# EasyEDA Pro project ProPrj_AD9363_Debug_2025-10-27.epro, schematic Schematic1

## Sheets
1 AD9363: Board Name: Board1; Create Date: 2025-09-24; Page Name: AD9363; Project Name: AD9363_Debug; Schematic Name: Schematic1; Update Date: 2025-09-24; Company: 嘉立创EDA; Page Size: A4; Version: V1.0
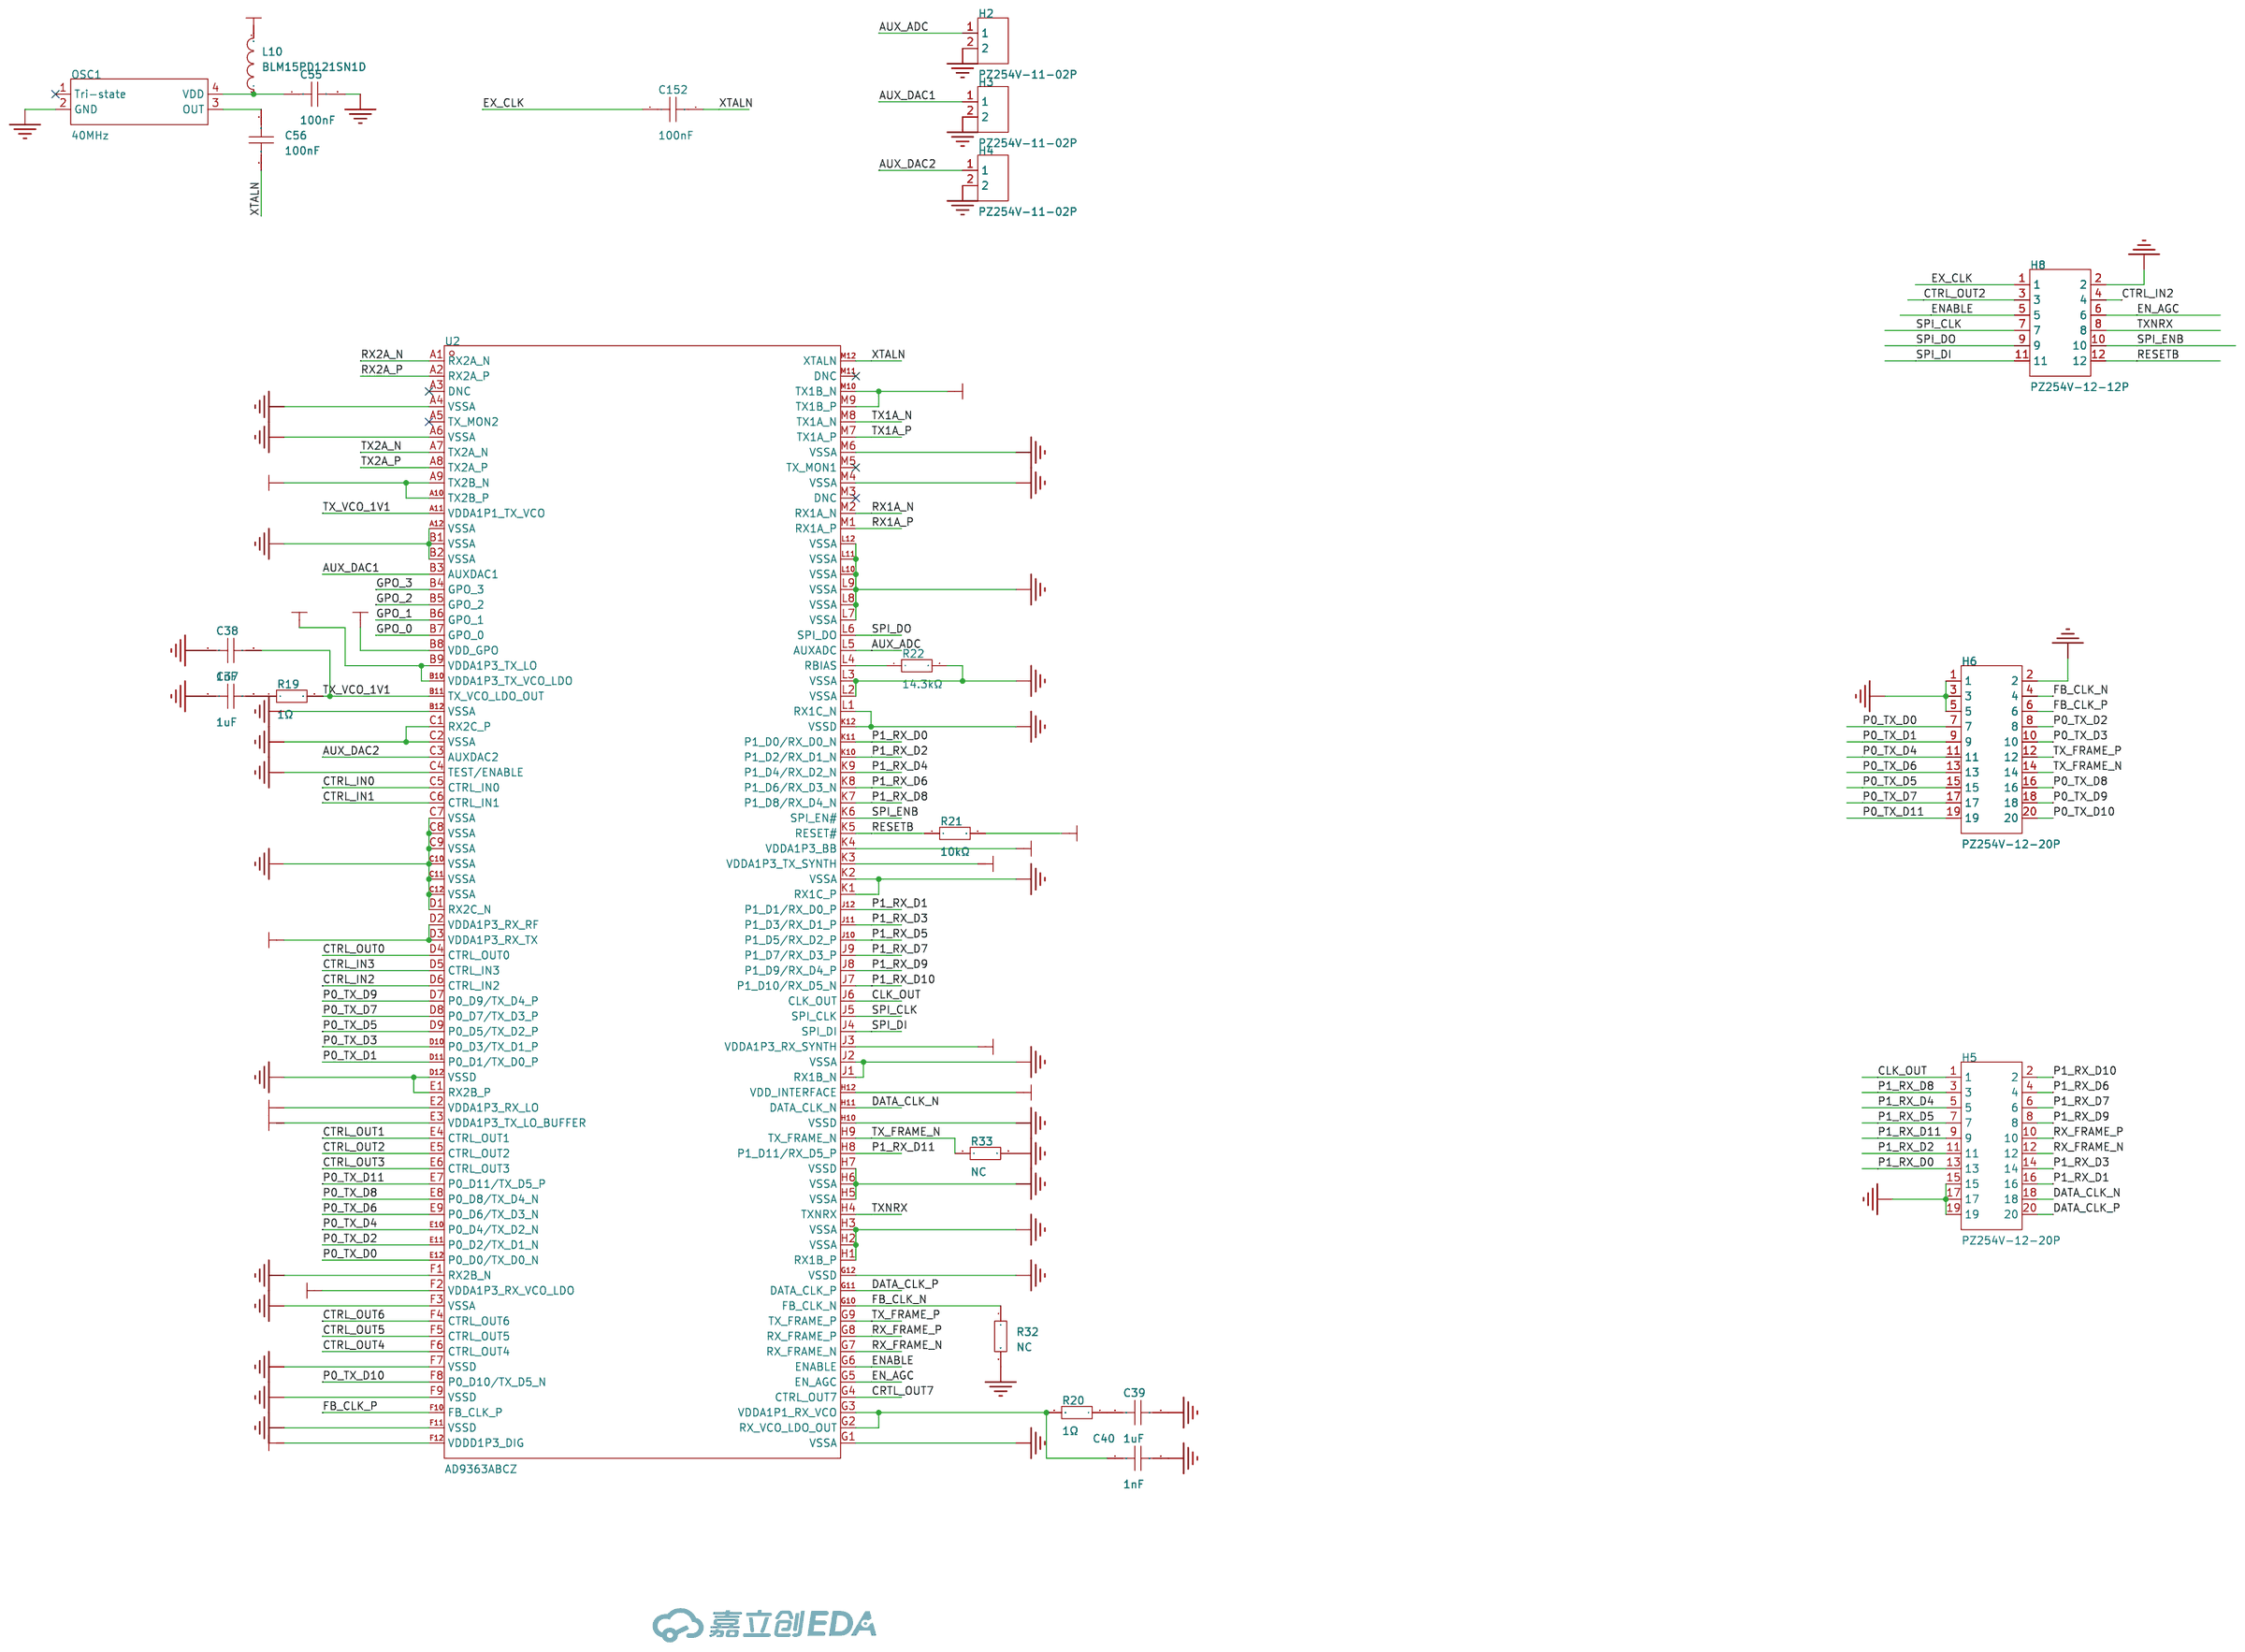
[diagram p0: AD9363]
2 Power: Page Name: Power
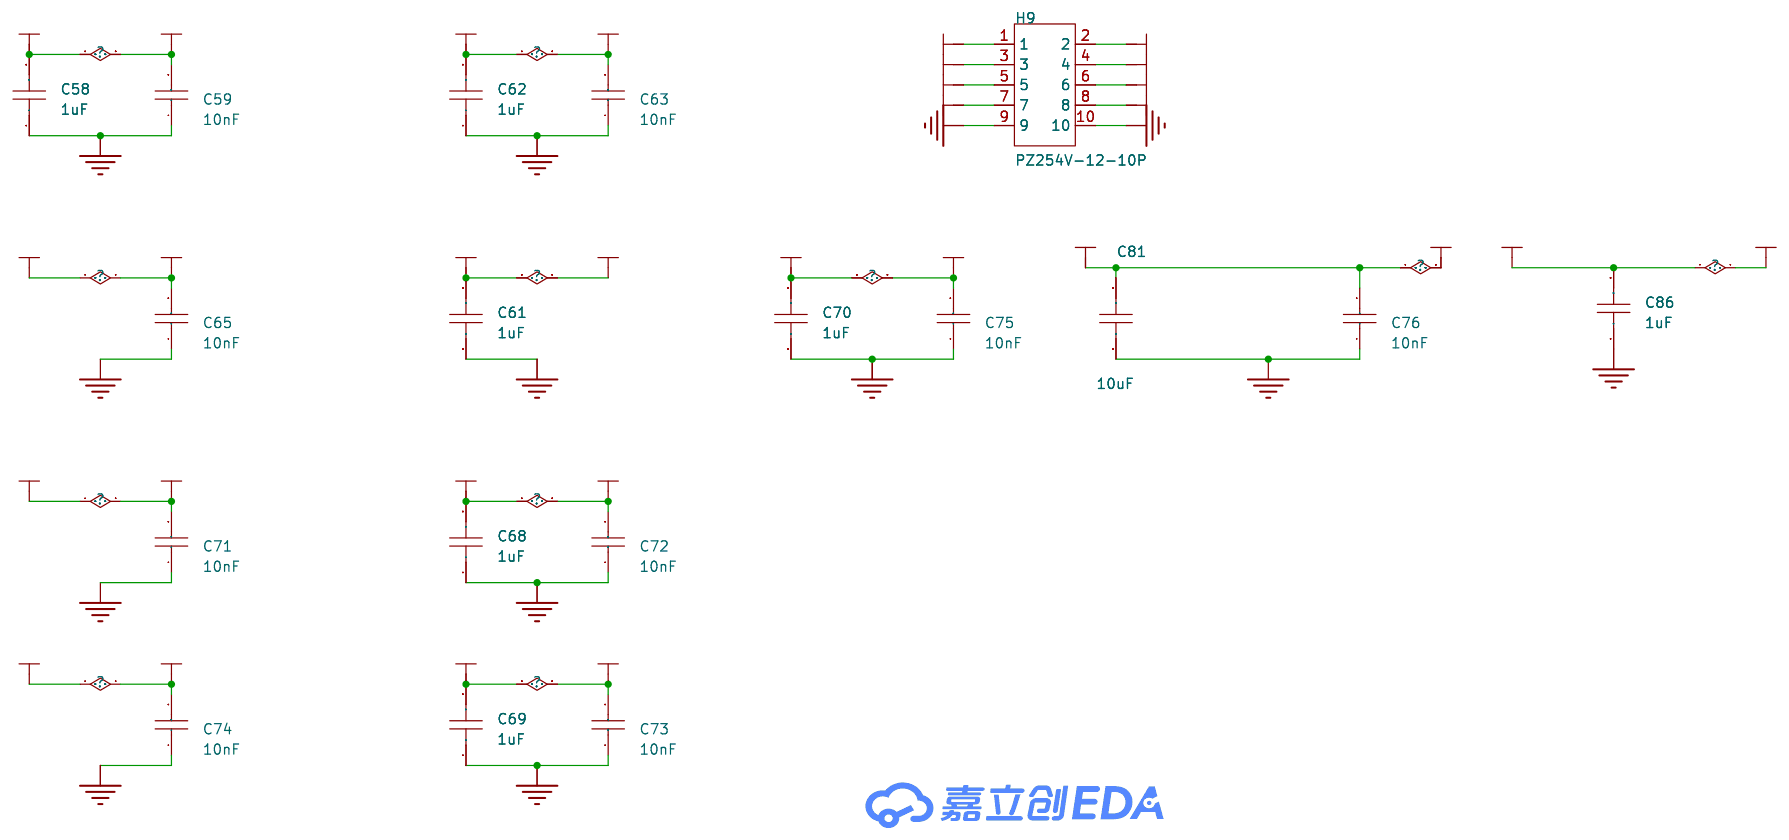
[diagram p1: Power]
3 RF: Page Name: RF
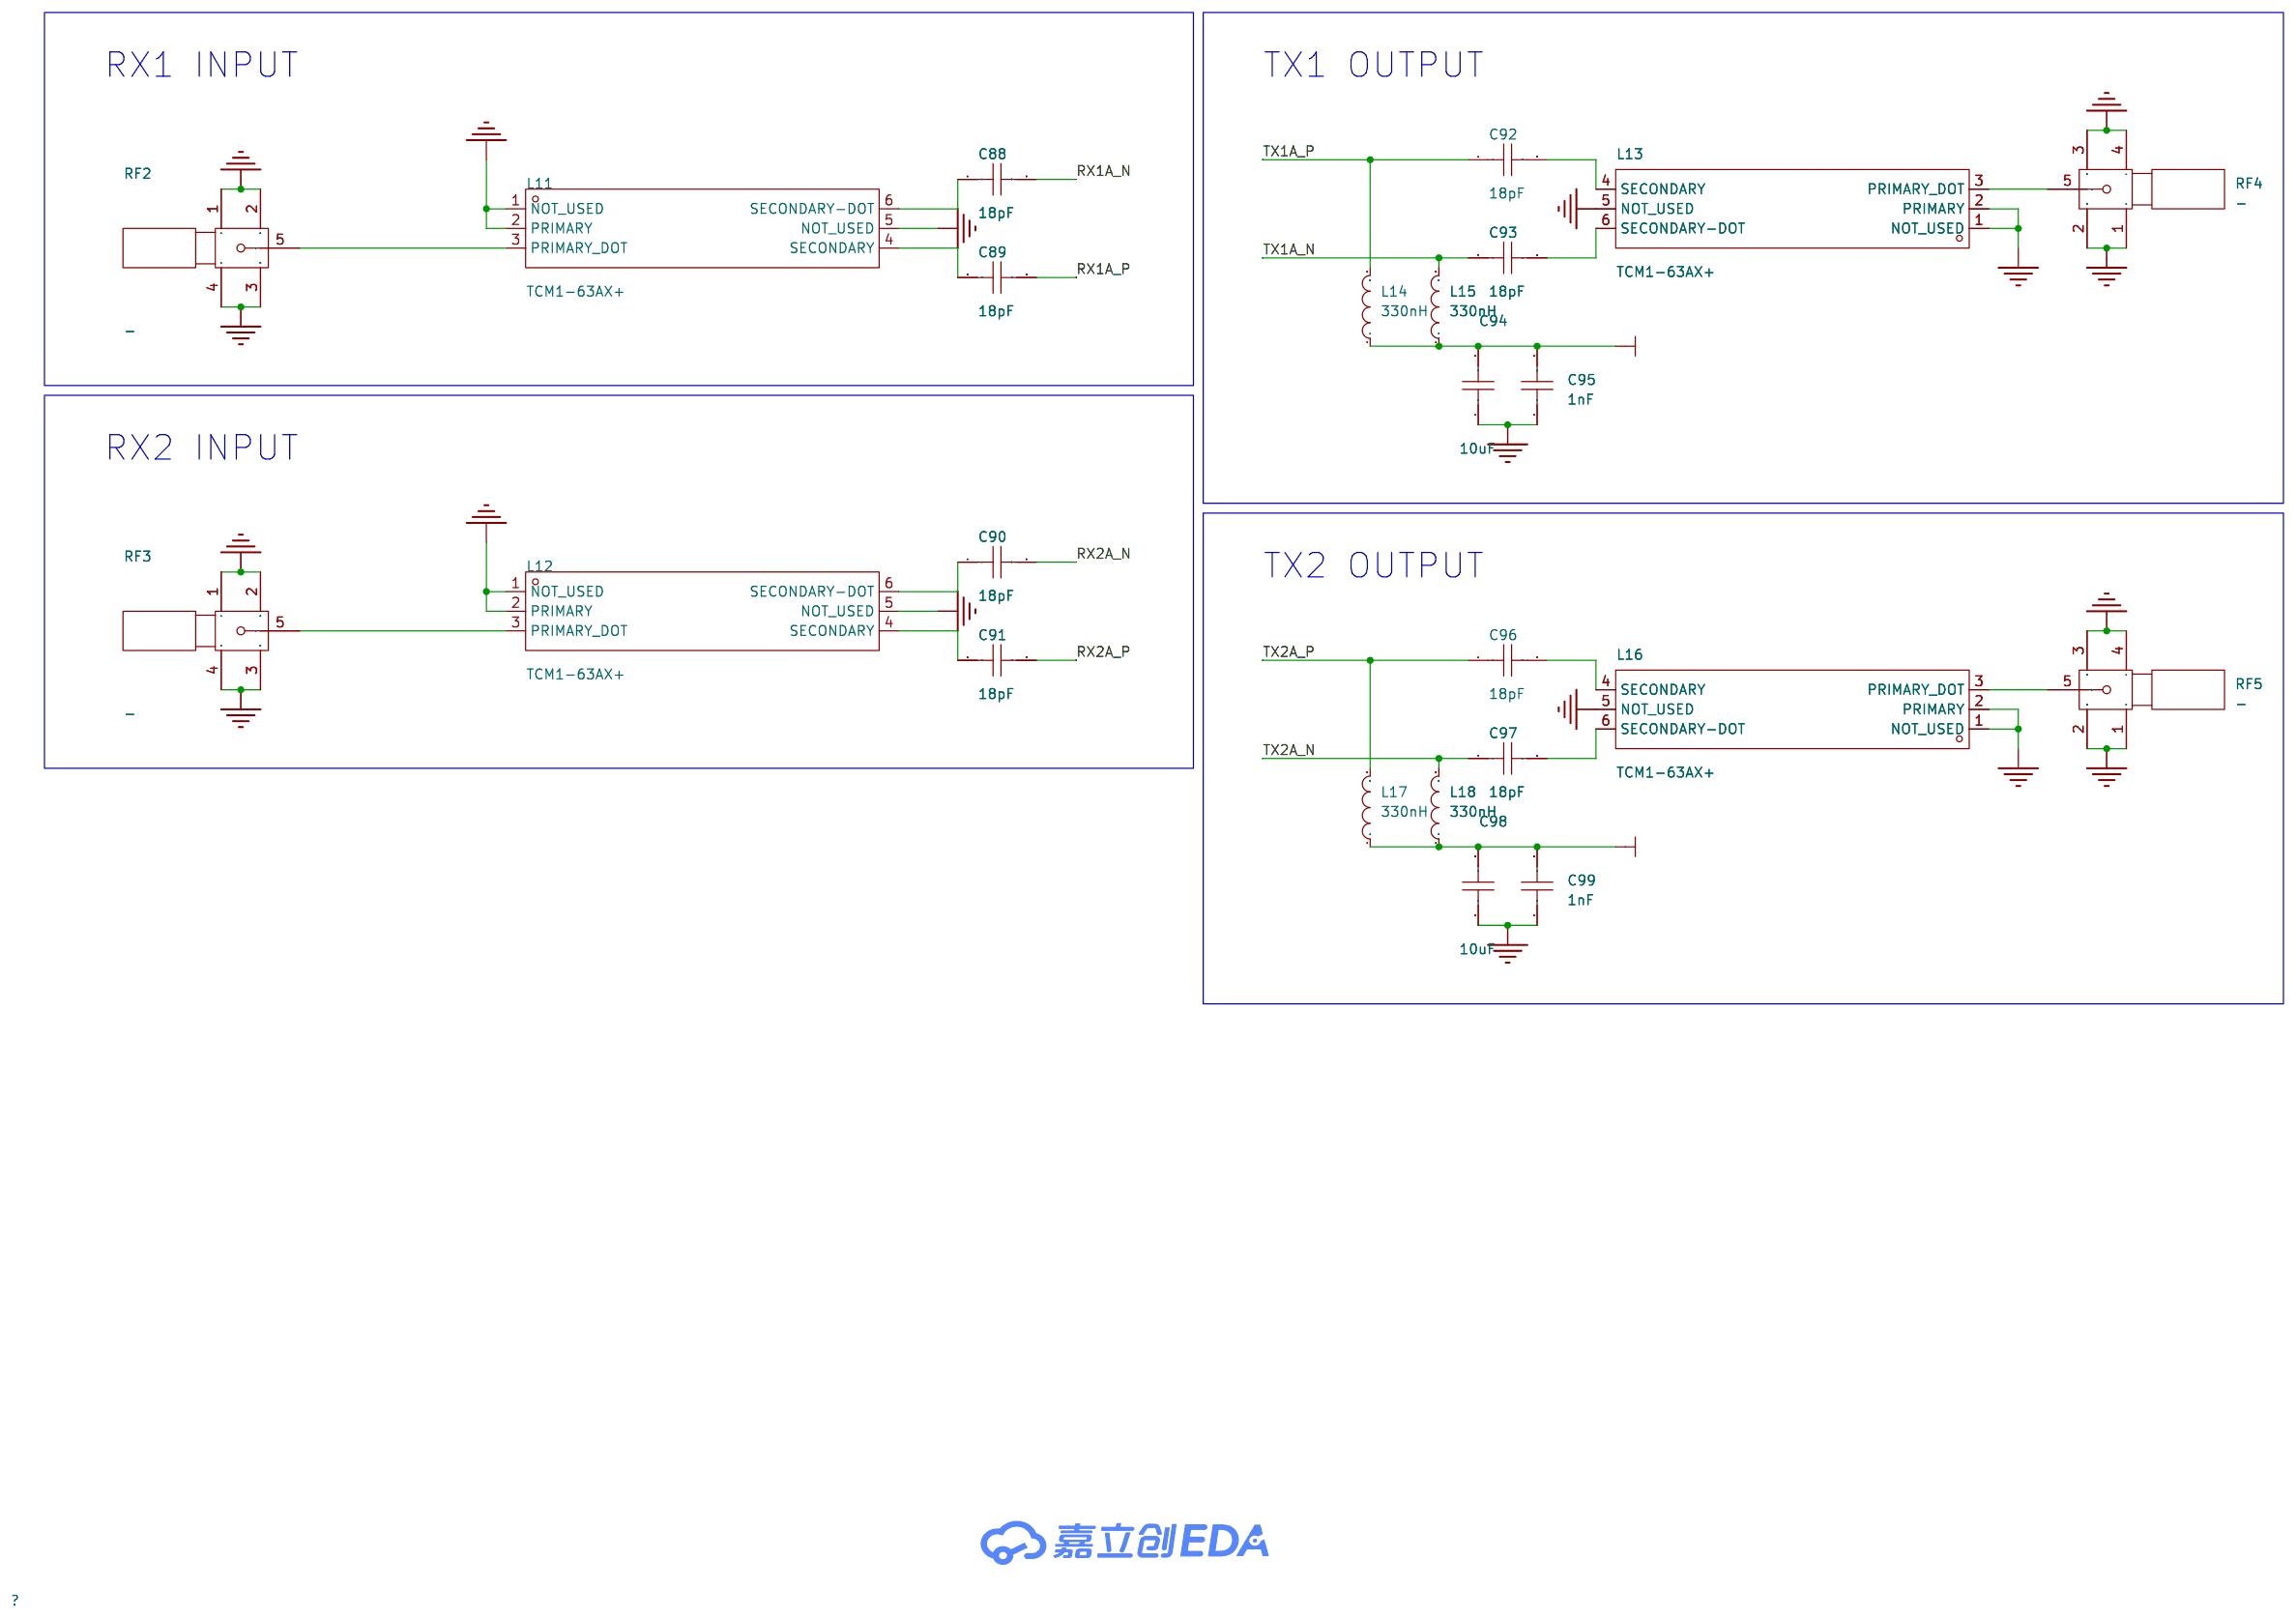
[diagram p2: RF]

## Parts
sheet AD9363
C37  1uF  [C0402]
C38  1nF  [C0402]
C39  1uF  [C0402]
C40  1nF  [C0402]
C55  100nF  [C0402]
C56  100nF  [C0402]
C152  100nF  [C0402]
H2  PZ254V-11-02P  [HDR-TH_2P-P2.54-V-M]
H3  PZ254V-11-02P  [HDR-TH_2P-P2.54-V-M]
H4  PZ254V-11-02P  [HDR-TH_2P-P2.54-V-M]
H5  PZ254V-12-20P  [HDR-TH_20P-P2.54-V-M-R2-C10-S2.54]
H6  PZ254V-12-20P  [HDR-TH_20P-P2.54-V-M-R2-C10-S2.54]
H8  PZ254V-12-12P  [HDR-TH_12P-P2.54-V-M-R2-C6-S2.54]
L10  BLM15PD121SN1D  [L0402]
OSC1  40MHz  [OSC-SMD_4P-L3.2-W2.5-BL]
R19  1Ω  [R0402]
R20  1Ω  [R0402]
R21  10kΩ  [R0402]
R22  14.3kΩ  [R0402]
R32  NC  [R0402]
R33  NC  [R0402]
U2  AD9363ABCZ  [CSPBGA-144_L10.0-W10.0-R12-C12-P0.80-TL]
sheet Power
C58  1uF  [C0402]
C59  10nF  [C0402]
C61  1uF  [C0402]
C62  1uF  [C0402]
C63  10nF  [C0402]
C65  10nF  [C0402]
C68  1uF  [C0402]
C69  1uF  [C0402]
C70  1uF  [C0402]
C71  10nF  [C0402]
C72  10nF  [C0402]
C73  10nF  [C0402]
C74  10nF  [C0402]
C75  10nF  [C0402]
C76  10nF  [C0402]
C81  10uF  [C0603]
C86  1uF  [C0402]
H9  PZ254V-12-10P  [HDR-TH_10P-P2.54-V-M-R2-C5-S2.54]
sheet RF
C88  18pF  [C0402]
C89  18pF  [C0402]
C90  18pF  [C0402]
C91  18pF  [C0402]
C92  18pF  [C0402]
C93  18pF  [C0402]
C94  10uF  [C0603]
C95  1nF  [C0402]
C96  18pF  [C0402]
C97  18pF  [C0402]
C98  10uF  [C0603]
C99  1nF  [C0402]
L11  TCM1-63AX+  [XFMR-SMD_TCM1-63AX]
L12  TCM1-63AX+  [XFMR-SMD_TCM1-63AX]
L13  TCM1-63AX+  [XFMR-SMD_TCM1-63AX]
L14  330nH  [IND-SMD_L1.0-W0.6]
L15  330nH  [IND-SMD_L1.0-W0.6]
L16  TCM1-63AX+  [XFMR-SMD_TCM1-63AX]
L17  330nH  [IND-SMD_L1.0-W0.6]
L18  330nH  [IND-SMD_L1.0-W0.6]
RF2  -  [SMA-SMD_BWSMA-KE-P001]
RF3  -  [SMA-SMD_BWSMA-KE-P001]
RF4  -  [SMA-SMD_BWSMA-KE-P001]
RF5  -  [SMA-SMD_BWSMA-KE-P001]

## Library data of the parts
C37 C39 C58 C61 C62 C68-C70 C86 = CL05A105KA5NQNC: 容值:1uF;精度:±10%;额定电压:25V;温度系数:X5R;; LCSC Part Name: 1uF ±10% 25V; Supplier Part: C52923; Manufacturer: SAMSUNG(三星); Supplier Footprint: 0402; JLCPCB Part Class: 基础库; Datasheet: https://item.szlcsc.com/datasheet/CL05A105KA5NQNC/53938.html; Supplier: LCSC; Tolerance: ±10%; Voltage Rating: 25V; Temperature Coefficient: X5R
C38 C40 C95 C99 = GRM1555C1H102JA01D: 容值:1nF;精度:±5%;额定电压:50V;温度系数:C0G;; LCSC Part Name: 1nF ±5% 50V; Supplier Part: C76947; Manufacturer: muRata(村田); Supplier Footprint: 0402; JLCPCB Part Class: 扩展库; Datasheet: https://item.szlcsc.com/datasheet/GRM1555C1H102JA01D/78074.html; Supplier: LCSC; Tolerance: ±5%; Voltage Rating: 50V; Temperature Coefficient: C0G
C55 C152 = CL05B104KB54PNC: 容值:100nF;精度:±10%;额定电压:50V;温度系数:X7R;; LCSC Part Name: 100nF ±10% 50V; Supplier Part: C307331; Manufacturer: SAMSUNG(三星); Supplier Footprint: 0402; JLCPCB Part Class: 基础库; Datasheet: https://item.szlcsc.com/datasheet/CL05B104KB54PNC/291005.html; Supplier: LCSC; Tolerance: ±10%; Voltage Rating: 50V; Temperature Coefficient: X7R
C56 = CL05B104KO5NNNC: 容值:100nF;精度:±10%;额定电压:16V;材质(温度系数):X7R;; LCSC Part Name: 100nF ±10% 16V; Supplier Part: C1525; Manufacturer: SAMSUNG(三星); Supplier Footprint: 0402; JLCPCB Part Class: 基础库; Datasheet: https://atta.szlcsc.com/upload/public/pdf/source/20160218/1457707763339.pdf; Supplier: LCSC; Tolerance: ±10%; Voltage Rated: 16V; Temperature Coefficient: X7R
H2-H4 = PZ254V-11-02P: 插针结构:1x2P;间距:2.54mm;行距:-;圆针/方针:方针;安装方式:直插;排数:单排;总PIN位数:2P;额定电流:-;额定电压:-;配合针长度:6mm;塑高:2.5mm;端接针长度:3mm;触头材质:黄铜;触头镀层:-;工作温度:-40℃~+105℃;颜色:黑色;; LCSC Part Name: 1x2P 间距:2.54mm 方针 直插; Supplier Part: C492401; Manufacturer: XFCN(兴飞); Supplier Footprint: 插件,P=2.54mm; JLCPCB Part Class: 扩展库; Datasheet: https://item.szlcsc.com/datasheet/PZ254V-11-02P/502957.html; Supplier: LCSC; Pin Structure: 1x2P; Pitch: 2.54mm; Circluar Pins/Square Pins: 方针; Mounting Type: 直插; Number of Rows: 单排; Number of Pins: 2P; Length of Mating Pin: 6mm; Insulation Height: 2.5mm; Length of End Connection Pin: 3mm; Contact Material: 黄铜; Operating Temperature: -40℃~+105℃; Color: 黑色
H5 H6 = PZ254V-12-20P: 插针结构:2x10P;间距:2.54mm;行距:2.54mm;圆针/方针:方针;安装方式:直插;排数:双排;总PIN位数:20P;额定电流:-;额定电压:-;配合针长度:6mm;塑高:2.5mm;端接针长度:3mm;触头材质:黄铜;触头镀层:-;工作温度:-40℃~+105℃;颜色:黑色;; LCSC Part Name: 2x10P 间距:2.54mm 方针 直插; Supplier Part: C492427; Manufacturer: XFCN(兴飞); Supplier Footprint: 插件,P=2.54mm; JLCPCB Part Class: 扩展库; Datasheet: https://item.szlcsc.com/datasheet/PZ254V-12-20P/502983.html; Supplier: LCSC; Pin Structure: 2x10P; Pitch: 2.54mm; Row Spacing: 2.54mm; Circluar Pins/Square Pins: 方针; Mounting Type: 直插; Number of Rows: 双排; Number of Pins: 20P; Length of Mating Pin: 6mm; Insulation Height: 2.5mm; Length of End Connection Pin: 3mm; Contact Material: 黄铜; Operating Temperature: -40℃~+105℃; Color: 黑色
H8 = PZ254V-12-12P: 插针结构:2x6P;间距:2.54mm;行距:2.54mm;圆针/方针:方针;安装方式:直插;排数:双排;总PIN位数:12P;额定电流:-;额定电压:-;配合针长度:6mm;塑高:2.5mm;端接针长度:3mm;触头材质:黄铜;触头镀层:-;工作温度:-40℃~+105℃;颜色:黑色;; LCSC Part Name: 2x6P 间距:2.54mm 方针 直插; Supplier Part: C492423; Manufacturer: XFCN(兴飞); Supplier Footprint: 插件,P=2.54mm; JLCPCB Part Class: 扩展库; Datasheet: https://item.szlcsc.com/datasheet/PZ254V-12-12P/502979.html; Supplier: LCSC; Pin Structure: 2x6P; Pitch: 2.54mm; Row Spacing: 2.54mm; Circluar Pins/Square Pins: 方针; Mounting Type: 直插; Number of Rows: 双排; Number of Pins: 12P; Length of Mating Pin: 6mm; Insulation Height: 2.5mm; Length of End Connection Pin: 3mm; Contact Material: 黄铜; Operating Temperature: -40℃~+105℃; Color: 黑色
L10 = BLM15PD121SN1D: 阻抗@频率:120Ω@100MHz;误差:±25%;直流电阻(DCR):90mΩ;; LCSC Part Name: 单路 0402磁珠 阻抗120Ω@100MHz; Supplier Part: C76891; Manufacturer: muRata(村田); Supplier Footprint: 0402; JLCPCB Part Class: 扩展库; Datasheet: https://item.szlcsc.com/datasheet/BLM15PD121SN1D/78018.html; Supplier: LCSC; Impedance @ Frequency: 120Ω@100MHz; Tolerance: ±25%; DC Resistance(DCR): 90mΩ; Current Rating: 1.3A; Number of Circuits: 1; Operating Temperature: -55℃~+125℃
OSC1 = OT2EL4C4JI-111OLP-40M: 频率:40MHz;常温频差:±10ppm;输出模式:CMOS;工作电压:1.8V~3.3V;频率稳定度:±20ppm;; LCSC Part Name: YSO110TR 40MHZ 4P 3225 1.8V-3.3V ±10PPM -40~85℃ (±20PPM) CMOS; Supplier Part: C5203551; Manufacturer: YXC(扬兴晶振); Supplier Footprint: SMD3225-4P; JLCPCB Part Class: 扩展库; Datasheet: https://item.szlcsc.com/datasheet/OT2EL4C4JI-111OLP-40M/5892913.html; Supplier: LCSC; Normal temperature Frequency Tolerance: ±10ppm; Output Type: CMOS; Voltage - Supply: 1.8V~3.3V; Frequency Stability: ±20ppm; Operating Temperature: -40℃~+85℃
R19 R20 R32 R33 = 0402WGF100KTCE: 电阻类型:厚膜电阻;阻值:1Ω;精度:±1%;功率:62.5mW;工作电压:50V;温度系数:±200ppm/℃;; LCSC Part Name: 1Ω ±1% 62.5mW 厚膜电阻; Supplier Part: C25086; Manufacturer: UNI-ROYAL(厚声); Supplier Footprint: 0402; JLCPCB Part Class: 扩展库; Datasheet: https://item.szlcsc.com/datasheet/0402WGF100KTCE/25829.html; Supplier: LCSC; Type: 厚膜电阻; Tolerance: ±1%; Power(Watts): 62.5mW; Voltage-Supply(Max): 50V; Temperature Coefficient: ±200ppm/℃; Operating Temperature: -55℃~+155℃
R21 = 0402WGF1002TCE: 电阻类型:厚膜电阻;阻值:10kΩ;精度:±1%;功率:62.5mW;工作电压:50V;温度系数:±100ppm/℃;; LCSC Part Name: 10kΩ ±1% 62.5mW 厚膜电阻; Supplier Part: C25744; Manufacturer: UNI-ROYAL(厚声); Supplier Footprint: 0402; JLCPCB Part Class: Basic Part; Datasheet: https://item.szlcsc.com/datasheet/0402WGF1002TCE/26487.html; Supplier: LCSC; Type: 厚膜电阻; Tolerance: ±1%; Power(Watts): 62.5mW; Voltage-Supply(Max): 50V; Temperature Coefficient: ±100ppm/℃; Operating Temperature: -55℃~+155℃
R22 = 0402WGF1432TCE: 电阻类型:厚膜电阻;阻值:14.3kΩ;精度:±1%;功率:62.5mW;工作电压:50V;温度系数:±100ppm/℃;; LCSC Part Name: 14.3kΩ ±1% 62.5mW 厚膜电阻; Supplier Part: C25855; Manufacturer: UNI-ROYAL(厚声); Supplier Footprint: 0402; JLCPCB Part Class: 扩展库; Datasheet: https://item.szlcsc.com/datasheet/0402WGF1432TCE/26598.html; Supplier: LCSC; Type: 厚膜电阻; Tolerance: ±1%; Power(Watts): 62.5mW; Voltage-Supply(Max): 50V; Temperature Coefficient: ±100ppm/℃; Operating Temperature: -55℃~+155℃
U2 = AD9363ABCZ: 频率范围:325MHz~3.8GHz;接口类型:SPI;数据速率:61.44Mbps;灵敏度:-;; LCSC Part Name: RF捷变收发器; Supplier Part: C653459; Manufacturer: ADI(亚德诺); Supplier Footprint: BGA-144; JLCPCB Part Class: 扩展库; Datasheet: https://atta.szlcsc.com/upload/public/pdf/source/20220412/30BFD9AEBDDCA38EF2B895CFB1D3E141.pdf; Supplier: LCSC; Frequency Range: 325MHz~3.8GHz; Interface: SPI; Voltage - Supply: 1.3V; Output Power: 8dBm; Data Rate: 61.44Mbps; Current Of Transmitting: 660mA; Receive Current: 660mA; Operating Temperature: -40℃~+85℃
C59 C63 C65 C71-C76 = CC0402KRX7R9BB103: 容值:10nF;精度:±10%;额定电压:50V;温度系数:X7R;; LCSC Part Name: 10nF ±10% 50V; Supplier Part: C60133; Manufacturer: YAGEO(国巨); Supplier Footprint: 0402; JLCPCB Part Class: 扩展库; Datasheet: https://item.szlcsc.com/datasheet/CC0402KRX7R9BB103/61185.html; Supplier: LCSC; Tolerance: ±10%; Voltage Rating: 50V; Temperature Coefficient: X7R
C81 C94 C98 = CGA0603X5R106K100JT: 容值:10uF;精度:±10%;额定电压:10V;温度系数:X5R;; LCSC Part Name: 10uF ±10% 10V; Supplier Part: C6119842; Manufacturer: HRE(芯声); Supplier Footprint: 0603; JLCPCB Part Class: 扩展库; Supplier: LCSC; Tolerance: ±10%; Voltage Rating: 10V; Temperature Coefficient: X5R
H9 = PZ254V-12-10P: 插针结构:2x5P;间距:2.54mm;行距:2.54mm;圆针/方针:方针;安装方式:直插;排数:双排;总PIN位数:10P;额定电流:-;额定电压:-;配合针长度:6mm;塑高:2.5mm;端接针长度:3mm;触头材质:黄铜;触头镀层:-;工作温度:-40℃~+105℃;颜色:黑色;; LCSC Part Name: 2x5P 间距:2.54mm 方针 直插; Supplier Part: C492422; Manufacturer: XFCN(兴飞); Supplier Footprint: 插件,P=2.54mm; JLCPCB Part Class: 扩展库; Datasheet: https://item.szlcsc.com/datasheet/PZ254V-12-10P/502978.html; Supplier: LCSC; Pin Structure: 2x5P; Pitch: 2.54mm; Row Spacing: 2.54mm; Circluar Pins/Square Pins: 方针; Mounting Type: 直插; Number of Rows: 双排; Number of Pins: 10P; Length of Mating Pin: 6mm; Insulation Height: 2.5mm; Length of End Connection Pin: 3mm; Contact Material: 黄铜; Operating Temperature: -40℃~+105℃; Color: 黑色
C88-C93 C96 C97 = GRM1555C1H180JA01D: 容值:18pF;精度:±5%;额定电压:50V;材质(温度系数):C0G;; LCSC Part Name: 18pF ±5% 50V; Supplier Part: C33149; Manufacturer: muRata(村田); Supplier Footprint: 0402; JLCPCB Part Class: 扩展库; Datasheet: https://atta.szlcsc.com/upload/public/pdf/source/20161108/1478586362936.pdf; Supplier: LCSC; Tolerance: ±5%; Voltage Rated: 50V; Temperature Coefficient: C0G
L11-L13 L16 = TCM1-63AX+: 频率范围:10MHz~6GHz;阻抗比-不平衡/平衡:50Ω:50Ω;插入损耗(最大值):-;相位差:8°;回波损耗(最小值):9.42dB;; Supplier Part: C494678; Manufacturer: Mini-Circuits; Supplier Footprint: SMD-6P; JLCPCB Part Class: 扩展库; Datasheet: https://item.szlcsc.com/datasheet/TCM1-63AX%252B/505421.html; Supplier: LCSC; Frequency Range: 10MHz~6GHz; Impedance - Unbalanced/Balanced: 50Ω:50Ω; Phase Difference: 8°; Amplitude Balance (Max): 0.5dB; Return Loss(Min): 9.42dB; Operating Temperature: -40℃~+85℃
L14 L15 L17 L18 = LQW15CNR33J10D: 电感值:330nH;精度:±5%;额定电流:390mA;饱和电流(Isat):-;; LCSC Part Name: 330nH ±5%; Supplier Part: C703730; Manufacturer: muRata(村田); Supplier Footprint: 0402; JLCPCB Part Class: 扩展库; Datasheet: https://atta.szlcsc.com/upload/public/pdf/source/20191022/C440248_094C93E028FCF0FA66FA57BC1ADCD3EF.pdf; Supplier: LCSC; Tolerance: ±5%; Rated Current: 390mA; DC Resistance (DCR): 560mΩ
RF2-RF5 = BWSMA-KE-P001: 连接器类型:板端;接口类型:内孔;端口数量:1;接口直径:5.2mm;接口长度/高度:-;频率:-;射频系列:SMA;阻抗:50Ω;样式:偏脚;工作温度:-;; LCSC Part Name: 内孔 SMA 偏脚; Supplier Part: C496550; Manufacturer: BAT WIRELESS(蝙蝠无线); Supplier Footprint: SMD; JLCPCB Part Class: 扩展库; Datasheet: https://atta.szlcsc.com/upload/public/pdf/source/20240320/28FD502871C976DFF213ABFCF2A0ED51.pdf; Supplier: LCSC; Connector Type: 板端; Interface: 内孔; Number of Ports: 1; Interface Diameter: 5.2mm; RF Series: SMA; Impedance: 50Ω; Style: 偏脚

## Nets
1V3_A: C58.2 C59.2 C61.2 C62.2 C63.2 C65.2 H9.5 H9.6 U2.B9(VDDA1P3_TX_LO) U2.B10(VDDA1P3_TX_VCO_LDO) U2.E2(VDDA1P3_RX_LO) U2.F2(VDDA1P3_RX_VCO_LDO) U2.J3(VDDA1P3_RX_SYNTH) U2.K3(VDDA1P3_TX_SYNTH)
1V3_B: C68.2 C69.2 C70.2 C71.2 C72.2 C73.2 C74.2 C75.2 C94.2 C95.2 C98.2 C99.2 H9.3 H9.4 L14.1 L15.1 L17.1 L18.1 U2.A9(TX2B_N) U2.A10(TX2B_P) U2.D2(VDDA1P3_RX_RF) U2.D3(VDDA1P3_RX_TX) U2.E3(VDDA1P3_TX_LO_BUFFER) U2.F12(VDDD1P3_DIG) U2.K4(VDDA1P3_BB) U2.M9(TX1B_P) U2.M10(TX1B_N)
1V8: C76.2 C81.2 H9.7 H9.8 L10.2 R21.2 U2.H12(VDD_INTERFACE)
3V3: C86.2 H9.1 H9.2 U2.B8(VDD_GPO)
GND: C37.1 C38.2 C39.1 C40.2 C55.2 C58.1 C59.1 C61.1 C62.1 C63.1 C65.1 C68.1 C69.1 C70.1 C71.1 C72.1 C73.1 C74.1 C75.1 C76.1 C81.1 C86.1 C94.1 C95.1 C98.1 C99.1 H2.2 H3.2 H4.2 H5.15 H5.17 H5.19 H6.1 H6.2 H6.3 H6.5 H8.2 H9.9 H9.10 L11.1(NOT USED) L11.2(PRIMARY) L11.5(NOT USED) L12.1(NOT USED) L12.2(PRIMARY) L12.5(NOT USED) L13.1(NOT USED) L13.2(PRIMARY) L13.5(NOT USED) L16.1(NOT USED) L16.2(PRIMARY) L16.5(NOT USED) OSC1.2(GND) R22.2 R32.2 R33.2 RF2.1 RF2.2 RF2.3 RF2.4 RF3.1 RF3.2 RF3.3 RF3.4 RF4.1 RF4.2 RF4.3 RF4.4 RF5.1 RF5.2 RF5.3 RF5.4 U2.A4(VSSA) U2.A6(VSSA) U2.A12(VSSA) U2.B1(VSSA) U2.B2(VSSA) U2.B12(VSSA) U2.C1(RX2C_P) U2.C2(VSSA) U2.C4(TEST/ENABLE) U2.C7(VSSA) U2.C8(VSSA) U2.C9(VSSA) U2.C10(VSSA) U2.C11(VSSA) U2.C12(VSSA) U2.D1(RX2C_N) U2.D12(VSSD) U2.E1(RX2B_P) U2.F1(RX2B_N) U2.F3(VSSA) U2.F7(VSSD) U2.F9(VSSD) U2.F11(VSSD) U2.G1(VSSA) U2.G12(VSSD) U2.H1(RX1B_P) U2.H2(VSSA) U2.H3(VSSA) U2.H5(VSSA) U2.H6(VSSA) U2.H7(VSSD) U2.H10(VSSD) U2.J1(RX1B_N) U2.J2(VSSA) U2.K1(RX1C_P) U2.K2(VSSA) U2.K12(VSSD) U2.L1(RX1C_N) U2.L2(VSSA) U2.L3(VSSA) U2.L7(VSSA) U2.L8(VSSA) U2.L9(VSSA) U2.L10(VSSA) U2.L11(VSSA) U2.L12(VSSA) U2.M4(VSSA) U2.M6(VSSA)
AUX_ADC: H2.1 U2.L5(AUXADC)
AUX_DAC1: H3.1 U2.B3(AUXDAC1)
AUX_DAC2: H4.1 U2.C3(AUXDAC2)
CLK_OUT: H5.1 U2.J6(CLK_OUT)
CRTL_OUT7: U2.G4(CTRL_OUT7)
CTRL_IN0: U2.C5(CTRL_IN0)
CTRL_IN1: U2.C6(CTRL_IN1)
CTRL_IN2: H8.4 U2.D6(CTRL_IN2)
CTRL_IN3: U2.D5(CTRL_IN3)
CTRL_OUT0: U2.D4(CTRL_OUT0)
CTRL_OUT1: U2.E4(CTRL_OUT1)
CTRL_OUT2: H8.3 U2.E5(CTRL_OUT2)
CTRL_OUT3: U2.E6(CTRL_OUT3)
CTRL_OUT4: U2.F6(CTRL_OUT4)
CTRL_OUT5: U2.F5(CTRL_OUT5)
CTRL_OUT6: U2.F4(CTRL_OUT6)
DATA_CLK_N: H5.18 U2.H11(DATA_CLK_N)
DATA_CLK_P: H5.20 U2.G11(DATA_CLK_P)
EN_AGC: H8.6 U2.G5(EN_AGC)
ENABLE: H8.5 U2.G6(ENABLE)
EX_CLK: C152.1 H8.1
FB_CLK_N: H6.4 R32.1 U2.G10(FB_CLK_N)
FB_CLK_P: H6.6 U2.F10(FB_CLK_P)
GPO_0: U2.B7(GPO_0)
GPO_1: U2.B6(GPO_1)
GPO_2: U2.B5(GPO_2)
GPO_3: U2.B4(GPO_3)
P0_TX_D0: H6.7 U2.E12(P0_D0/TX_D0_N)
P0_TX_D1: H6.9 U2.D11(P0_D1/TX_D0_P)
P0_TX_D2: H6.8 U2.E11(P0_D2/TX_D1_N)
P0_TX_D3: H6.10 U2.D10(P0_D3/TX_D1_P)
P0_TX_D4: H6.11 U2.E10(P0_D4/TX_D2_N)
P0_TX_D5: H6.15 U2.D9(P0_D5/TX_D2_P)
P0_TX_D6: H6.13 U2.E9(P0_D6/TX_D3_N)
P0_TX_D7: H6.17 U2.D8(P0_D7/TX_D3_P)
P0_TX_D8: H6.16 U2.E8(P0_D8/TX_D4_N)
P0_TX_D9: H6.18 U2.D7(P0_D9/TX_D4_P)
P0_TX_D10: H6.20 U2.F8(P0_D10/TX_D5_N)
P0_TX_D11: H6.19 U2.E7(P0_D11/TX_D5_P)
P1_RX_D0: H5.13 U2.K11(P1_D0/RX_D0_N)
P1_RX_D1: H5.16 U2.J12(P1_D1/RX_D0_P)
P1_RX_D2: H5.11 U2.K10(P1_D2/RX_D1_N)
P1_RX_D3: H5.14 U2.J11(P1_D3/RX_D1_P)
P1_RX_D4: H5.5 U2.K9(P1_D4/RX_D2_N)
P1_RX_D5: H5.7 U2.J10(P1_D5/RX_D2_P)
P1_RX_D6: H5.4 U2.K8(P1_D6/RX_D3_N)
P1_RX_D7: H5.6 U2.J9(P1_D7/RX_D3_P)
P1_RX_D8: H5.3 U2.K7(P1_D8/RX_D4_N)
P1_RX_D9: H5.8 U2.J8(P1_D9/RX_D4_P)
P1_RX_D10: H5.2 U2.J7(P1_D10/RX_D5_N)
P1_RX_D11: H5.9 U2.H8(P1_D11/RX_D5_P)
RESETB: H8.12 R21.1 U2.K5(RESET#)
RX1A_N: C88.2 U2.M2(RX1A_N)
RX1A_P: C89.2 U2.M1(RX1A_P)
RX2A_N: C90.2 U2.A1(RX2A_N)
RX2A_P: C91.2 U2.A2(RX2A_P)
RX_FRAME_N: H5.12 U2.G7(RX_FRAME_N)
RX_FRAME_P: H5.10 U2.G8(RX_FRAME_P)
SPI_CLK: H8.7 U2.J5(SPI_CLK)
SPI_DI: H8.11 U2.J4(SPI_DI)
SPI_DO: H8.9 U2.L6(SPI_DO)
SPI_ENB: H8.10 U2.K6(SPI_EN#)
TX1A_N: C93.1 L15.2 U2.M8(TX1A_N)
TX1A_P: C92.1 L14.2 U2.M7(TX1A_P)
TX2A_N: C97.1 L18.2 U2.A7(TX2A_N)
TX2A_P: C96.1 L17.2 U2.A8(TX2A_P)
TX_FRAME_N: H6.14 R33.1 U2.H9(TX_FRAME_N)
TX_FRAME_P: H6.12 U2.G9(TX_FRAME_P)
TX_VCO_1V1: C38.1 R19.2 U2.A11(VDDA1P1_TX_VCO) U2.B11(TX_VCO_LDO_OUT)
TXNRX: H8.8 U2.H4(TXNRX)
XTALN: C56.1 C152.2 U2.M12(XTALN)
$1N2875: C37.2 R19.1
$1N2947: C39.2 R20.1
$1N2949: C40.1 R20.2 U2.G2(RX_VCO_LDO_OUT) U2.G3(VDDA1P1_RX_VCO)
$1N3010: R22.1 U2.L4(RBIAS)
$1N3030: C55.1 L10.1 OSC1.4(VDD)
$1N3034: C56.2 OSC1.3(OUT)
$3N1695: L11.3(PRIMARY DOT) RF2.5
$3N1696: C88.1 L11.6(SECONDARY-DOT)
$3N1697: C89.1 L11.4(SECONDARY)
$3N1706: L12.3(PRIMARY DOT) RF3.5
$3N1707: C90.1 L12.6(SECONDARY-DOT)
$3N1708: C91.1 L12.4(SECONDARY)
$3N1714: L13.3(PRIMARY DOT) RF4.5
$3N1722: C92.2 L13.4(SECONDARY)
$3N1723: C93.2 L13.6(SECONDARY-DOT)
$3N1727: L16.3(PRIMARY DOT) RF5.5
$3N1735: C96.2 L16.4(SECONDARY)
$3N1736: C97.2 L16.6(SECONDARY-DOT)

Not connected (* = marked no-connect by the designer): OSC1 1(Tri-state)*; U2 A3(DNC)* A5(TX_MON2)* M3(DNC)* M5(TX_MON1)* M11(DNC)*

## Notes on the sheets
sheet 3
- RX1 INPUT
- TX1 OUTPUT
- RX2 INPUT
- TX2 OUTPUT
